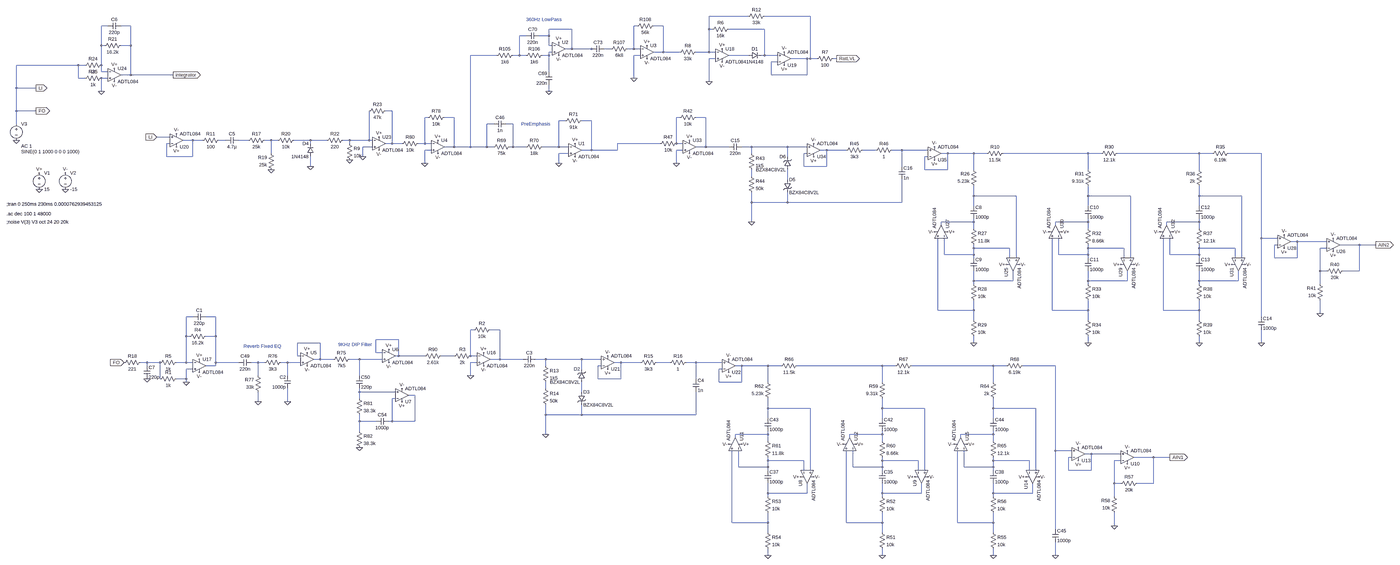
[diagram p0: schematic stargate_323_ltspice.asc, whole sheet]
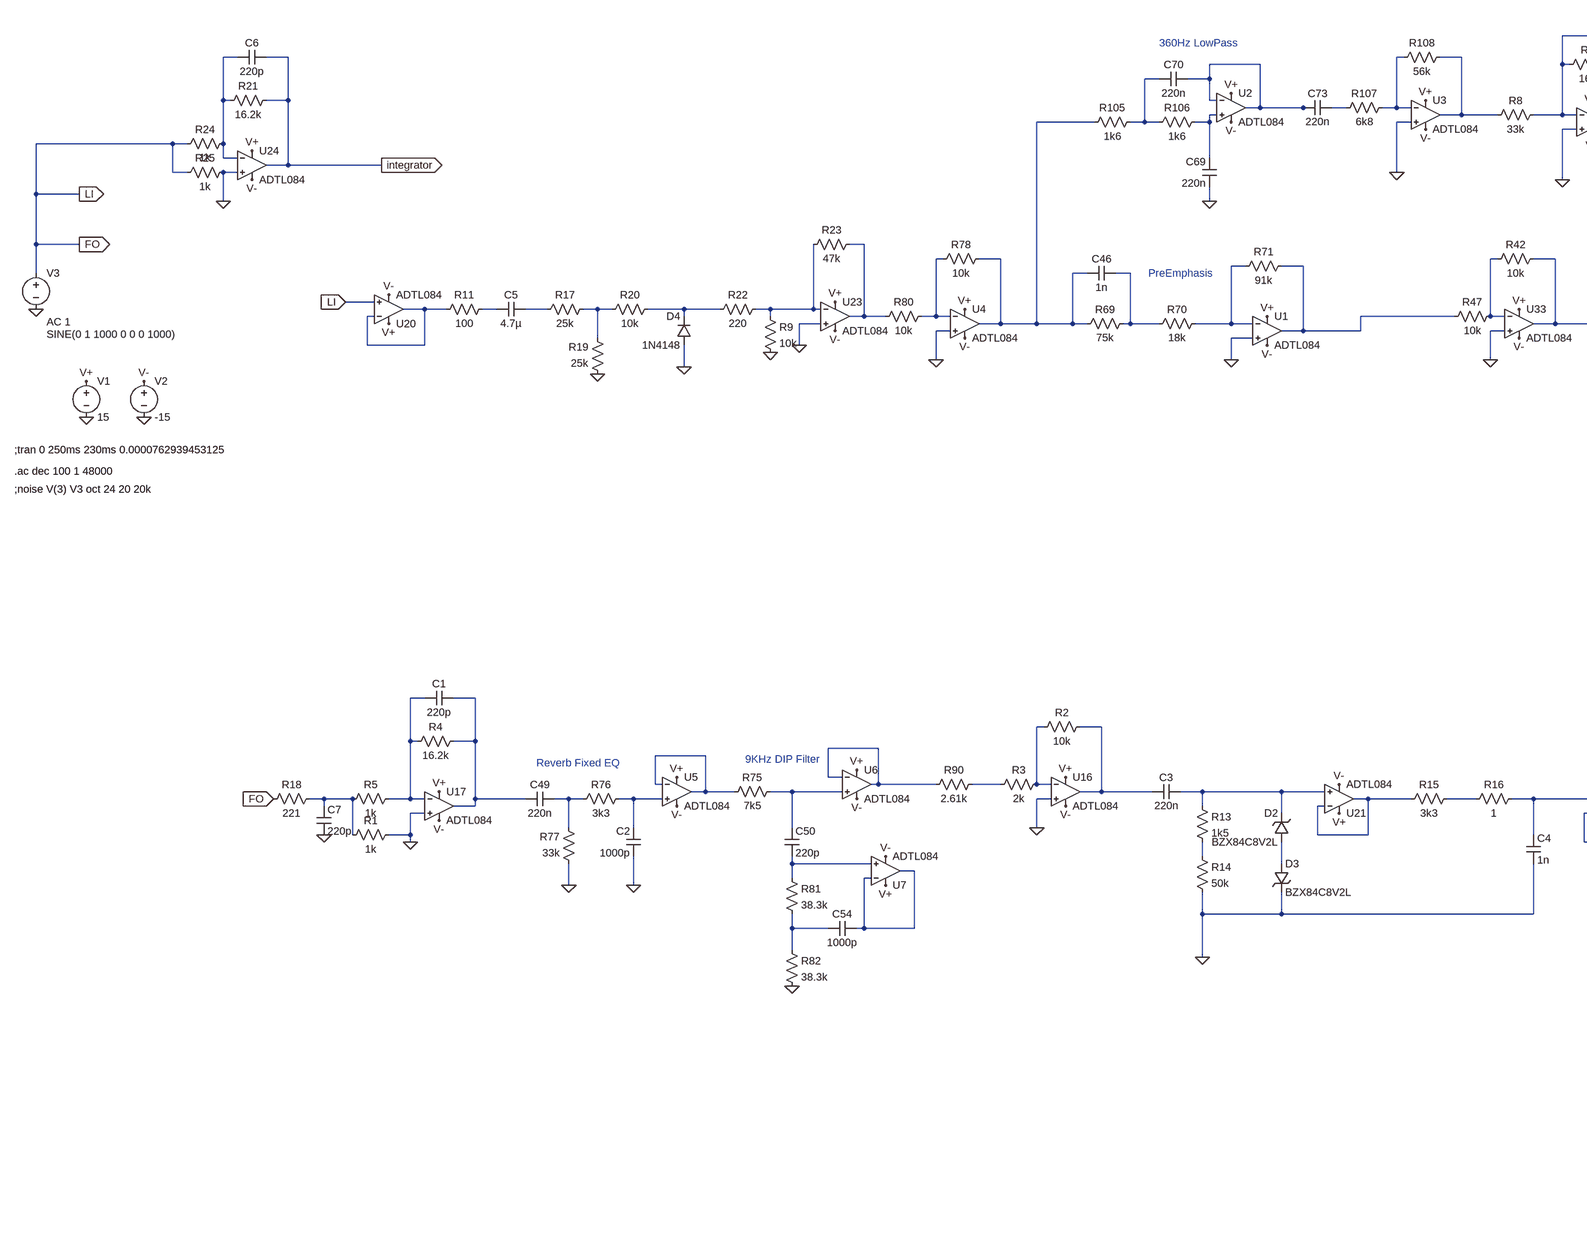
[diagram p1: schematic stargate_323_ltspice.asc, part, row 1 of 1, column 1 of 2]
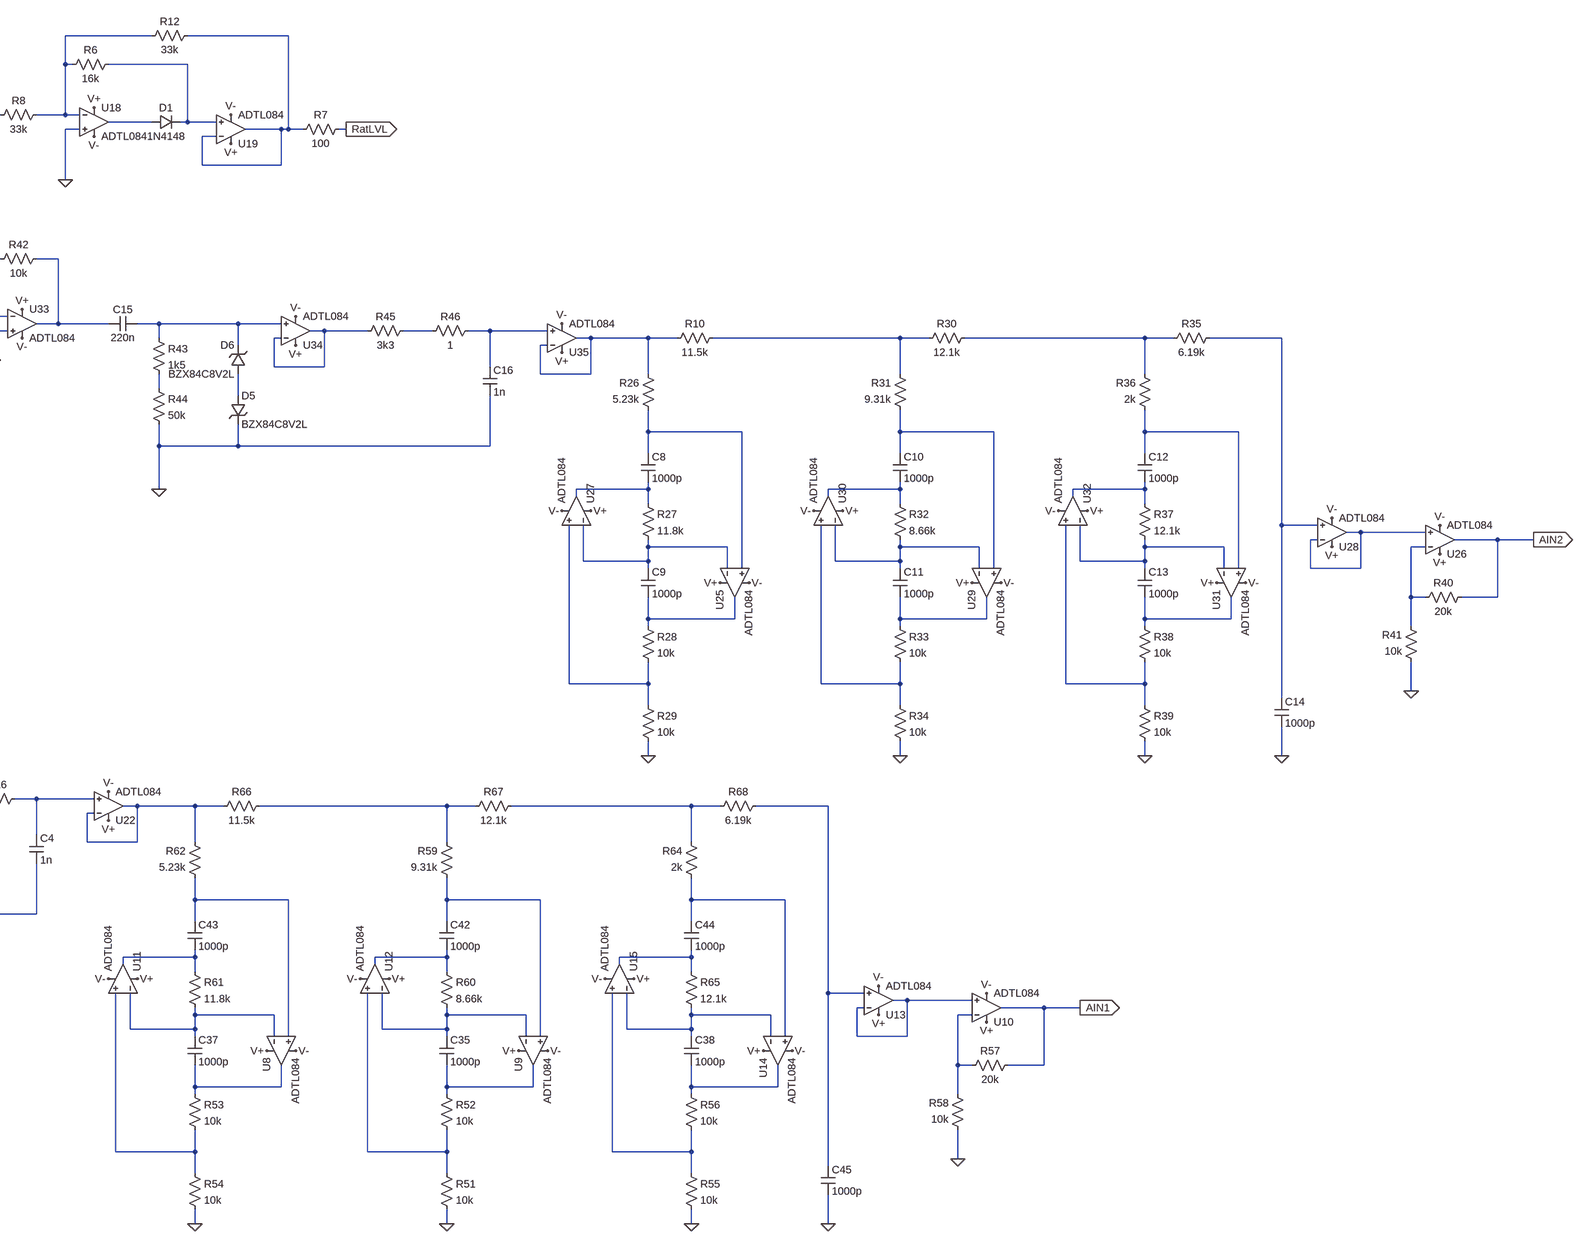
[diagram p2: schematic stargate_323_ltspice.asc, part, row 1 of 1, column 2 of 2]
stargate_323_ltspice.asc, the LTspice schematic file:
Version 4
SHEET 1 3908 2772
WIRE -416 112 -608 112
WIRE -112 112 -336 112
WIRE -3552 160 -3584 160
WIRE -3440 160 -3488 160
WIRE -960 160 -976 160
WIRE -832 160 -880 160
WIRE -1280 176 -1392 176
WIRE -608 176 -608 112
WIRE -592 176 -608 176
WIRE -336 176 -512 176
WIRE -1504 208 -1536 208
WIRE -1392 208 -1392 176
WIRE -1392 208 -1440 208
WIRE -3584 256 -3584 160
WIRE -3568 256 -3584 256
WIRE -3440 256 -3440 160
WIRE -3440 256 -3488 256
WIRE -1392 256 -1392 208
WIRE -1376 256 -1392 256
WIRE -1280 272 -1280 176
WIRE -1280 272 -1312 272
WIRE -1184 272 -1280 272
WIRE -1168 272 -1184 272
WIRE -1088 272 -1120 272
WIRE -976 272 -976 160
WIRE -976 272 -1008 272
WIRE -944 272 -976 272
WIRE -1376 288 -1392 288
WIRE -832 288 -832 160
WIRE -832 288 -880 288
WIRE -752 288 -832 288
WIRE -608 288 -608 176
WIRE -608 288 -672 288
WIRE -576 288 -608 288
WIRE -1648 304 -1776 304
WIRE -1536 304 -1536 208
WIRE -1536 304 -1568 304
WIRE -1504 304 -1536 304
WIRE -1392 304 -1392 288
WIRE -1392 304 -1424 304
WIRE -944 304 -976 304
WIRE -416 304 -512 304
WIRE -336 304 -336 176
WIRE -336 304 -352 304
WIRE -272 304 -336 304
WIRE -576 320 -608 320
WIRE -128 320 -208 320
WIRE -112 320 -112 112
WIRE -112 320 -128 320
WIRE -80 320 -112 320
WIRE 16 320 0 320
WIRE -272 336 -304 336
WIRE -3696 352 -4000 352
WIRE -3664 352 -3696 352
WIRE -3584 352 -3584 256
WIRE -3584 384 -3584 352
WIRE -3552 384 -3584 384
WIRE -1392 384 -1392 304
WIRE -3440 400 -3440 256
WIRE -3440 400 -3488 400
WIRE -3232 400 -3440 400
WIRE -304 400 -304 336
WIRE -128 400 -128 320
WIRE -128 400 -304 400
WIRE -3696 416 -3696 352
WIRE -3664 416 -3696 416
WIRE -3552 416 -3584 416
WIRE -976 416 -976 304
WIRE -608 432 -608 320
WIRE -4000 464 -4000 352
WIRE -3904 464 -4000 464
WIRE -3584 480 -3584 416
WIRE -1392 480 -1392 448
WIRE -4000 576 -4000 464
WIRE -3904 576 -4000 576
WIRE -2160 576 -2192 576
WIRE -1984 608 -2000 608
WIRE -1856 608 -1904 608
WIRE -752 608 -768 608
WIRE -624 608 -672 608
WIRE -1312 624 -1344 624
WIRE -1184 624 -1232 624
WIRE -4000 640 -4000 576
WIRE -1664 640 -1696 640
WIRE -1568 640 -1600 640
WIRE -3248 704 -3312 704
WIRE -3136 720 -3184 720
WIRE -3088 720 -3136 720
WIRE -2976 720 -3008 720
WIRE -2864 720 -2912 720
WIRE -2752 720 -2784 720
WIRE -2720 720 -2752 720
WIRE -2560 720 -2640 720
WIRE -2480 720 -2560 720
WIRE -2368 720 -2400 720
WIRE -2272 720 -2272 576
WIRE -2272 720 -2368 720
WIRE -2256 720 -2272 720
WIRE -3248 736 -3264 736
WIRE -2560 736 -2560 720
WIRE -2368 736 -2368 720
WIRE -2160 736 -2160 576
WIRE -2160 736 -2192 736
WIRE -2112 736 -2160 736
WIRE -2000 736 -2000 608
WIRE -2000 736 -2032 736
WIRE -1968 736 -2000 736
WIRE -848 736 -1056 736
WIRE -768 736 -768 608
WIRE -736 736 -768 736
WIRE -2256 752 -2304 752
WIRE -1856 752 -1856 608
WIRE -1856 752 -1904 752
WIRE -1776 752 -1776 304
WIRE -1776 752 -1856 752
WIRE -1696 752 -1696 640
WIRE -1696 752 -1776 752
WIRE -1664 752 -1696 752
WIRE -1568 752 -1568 640
WIRE -1568 752 -1584 752
WIRE -1504 752 -1568 752
WIRE -1344 752 -1344 624
WIRE -1344 752 -1424 752
WIRE -1296 752 -1344 752
WIRE -624 752 -624 608
WIRE -624 752 -672 752
WIRE -512 752 -624 752
WIRE -400 752 -448 752
WIRE -224 752 -400 752
WIRE -128 752 -224 752
WIRE -1968 768 -2000 768
WIRE -1184 768 -1184 624
WIRE -1184 768 -1232 768
WIRE -1056 768 -1056 736
WIRE -1056 768 -1184 768
WIRE -736 768 -768 768
WIRE -32 768 -64 768
WIRE 64 768 -32 768
WIRE 208 768 144 768
WIRE 336 768 288 768
WIRE 464 768 336 768
WIRE -2752 784 -2752 720
WIRE -1296 784 -1344 784
WIRE -400 784 -400 752
WIRE -128 784 -144 784
WIRE 560 784 528 784
WIRE 688 784 560 784
WIRE 752 784 688 784
WIRE 1248 784 832 784
WIRE 1312 784 1248 784
WIRE 1792 784 1392 784
WIRE 1856 784 1792 784
WIRE 2096 784 1936 784
WIRE -3264 800 -3264 736
WIRE -3136 800 -3136 720
WIRE -3136 800 -3264 800
WIRE -2304 800 -2304 752
WIRE -224 800 -224 752
WIRE 464 800 448 800
WIRE -2000 832 -2000 768
WIRE -1344 832 -1344 784
WIRE -768 832 -768 768
WIRE -2560 848 -2560 800
WIRE -144 848 -144 784
WIRE -32 848 -32 768
WIRE -32 848 -144 848
WIRE 336 848 336 768
WIRE 448 864 448 800
WIRE 560 864 560 784
WIRE 560 864 448 864
WIRE 688 864 688 784
WIRE 1248 864 1248 784
WIRE 1792 864 1792 784
WIRE -400 896 -400 864
WIRE -224 912 -224 864
WIRE 688 992 688 944
WIRE 896 992 688 992
WIRE 1248 992 1248 944
WIRE 1456 992 1248 992
WIRE 1792 992 1792 944
WIRE 2000 992 1792 992
WIRE -400 1024 -400 976
WIRE -224 1024 -224 976
WIRE -224 1024 -400 1024
WIRE 336 1024 336 912
WIRE 336 1024 -224 1024
WIRE 688 1040 688 992
WIRE 1248 1040 1248 992
WIRE 1792 1040 1792 992
WIRE -400 1120 -400 1024
WIRE 688 1120 688 1104
WIRE 688 1120 528 1120
WIRE 1248 1120 1248 1104
WIRE 1248 1120 1088 1120
WIRE 1792 1120 1792 1104
WIRE 1792 1120 1632 1120
WIRE 528 1136 528 1120
WIRE 1088 1136 1088 1120
WIRE 1632 1136 1632 1120
WIRE 688 1152 688 1120
WIRE 1248 1152 1248 1120
WIRE 1792 1152 1792 1120
WIRE 2096 1200 2096 784
WIRE 2176 1200 2096 1200
WIRE 2272 1216 2240 1216
WIRE 2416 1216 2272 1216
WIRE 2176 1232 2160 1232
WIRE 2576 1232 2480 1232
WIRE 2656 1232 2576 1232
WIRE 688 1248 688 1232
WIRE 864 1248 688 1248
WIRE 1248 1248 1248 1232
WIRE 1424 1248 1248 1248
WIRE 1792 1248 1792 1232
WIRE 1968 1248 1792 1248
WIRE 2416 1248 2384 1248
WIRE 544 1280 544 1200
WIRE 688 1280 688 1248
WIRE 688 1280 544 1280
WIRE 1104 1280 1104 1200
WIRE 1248 1280 1248 1248
WIRE 1248 1280 1104 1280
WIRE 1648 1280 1648 1200
WIRE 1792 1280 1792 1248
WIRE 1792 1280 1648 1280
WIRE 688 1296 688 1280
WIRE 864 1296 864 1248
WIRE 896 1296 896 992
WIRE 1248 1296 1248 1280
WIRE 1424 1296 1424 1248
WIRE 1456 1296 1456 992
WIRE 1792 1296 1792 1280
WIRE 1968 1296 1968 1248
WIRE 2000 1296 2000 992
WIRE 2160 1296 2160 1232
WIRE 2272 1296 2272 1216
WIRE 2272 1296 2160 1296
WIRE 2384 1360 2384 1248
WIRE 2416 1360 2384 1360
WIRE 2576 1360 2576 1232
WIRE 2576 1360 2496 1360
WIRE 688 1408 688 1360
WIRE 880 1408 880 1360
WIRE 880 1408 688 1408
WIRE 1248 1408 1248 1360
WIRE 1440 1408 1440 1360
WIRE 1440 1408 1248 1408
WIRE 1792 1408 1792 1360
WIRE 1984 1408 1984 1360
WIRE 1984 1408 1792 1408
WIRE 688 1424 688 1408
WIRE 1248 1424 1248 1408
WIRE 1792 1424 1792 1408
WIRE 2384 1424 2384 1360
WIRE 512 1552 512 1200
WIRE 688 1552 688 1504
WIRE 688 1552 512 1552
WIRE 1072 1552 1072 1200
WIRE 1248 1552 1248 1504
WIRE 1248 1552 1072 1552
WIRE 1616 1552 1616 1200
WIRE 1792 1552 1792 1504
WIRE 1792 1552 1616 1552
WIRE 2384 1568 2384 1504
WIRE -3136 1584 -3168 1584
WIRE -3024 1584 -3072 1584
WIRE 2096 1584 2096 1200
WIRE 688 1600 688 1552
WIRE 1248 1600 1248 1552
WIRE 1792 1600 1792 1552
WIRE -1760 1648 -1776 1648
WIRE -1632 1648 -1680 1648
WIRE -3168 1680 -3168 1584
WIRE -3152 1680 -3168 1680
WIRE -3024 1680 -3024 1584
WIRE -3024 1680 -3072 1680
WIRE -2128 1696 -2240 1696
WIRE -2512 1712 -2624 1712
WIRE 688 1712 688 1680
WIRE 1248 1712 1248 1680
WIRE 1792 1712 1792 1680
WIRE 2096 1712 2096 1648
WIRE -2240 1760 -2240 1696
WIRE -2208 1760 -2240 1760
WIRE -2624 1776 -2624 1712
WIRE -2608 1776 -2624 1776
WIRE -2128 1776 -2128 1696
WIRE -2128 1776 -2144 1776
WIRE -2000 1776 -2128 1776
WIRE -1856 1776 -1920 1776
WIRE -1776 1776 -1776 1648
WIRE -1744 1776 -1776 1776
WIRE -2512 1792 -2512 1712
WIRE -2512 1792 -2544 1792
WIRE -2448 1792 -2512 1792
WIRE -2320 1792 -2368 1792
WIRE -2208 1792 -2320 1792
WIRE -1632 1792 -1632 1648
WIRE -1632 1792 -1680 1792
WIRE -1520 1792 -1632 1792
WIRE -1408 1792 -1456 1792
WIRE -1232 1792 -1408 1792
WIRE -1136 1792 -1232 1792
WIRE -3360 1808 -3392 1808
WIRE -3296 1808 -3360 1808
WIRE -3168 1808 -3168 1680
WIRE -3168 1808 -3216 1808
WIRE -3136 1808 -3168 1808
WIRE -3024 1808 -3024 1680
WIRE -2912 1808 -3024 1808
WIRE -2816 1808 -2848 1808
WIRE -2784 1808 -2816 1808
WIRE -2672 1808 -2704 1808
WIRE -2608 1808 -2672 1808
WIRE -1744 1808 -1776 1808
WIRE -1040 1808 -1072 1808
WIRE -944 1808 -1040 1808
WIRE -800 1808 -864 1808
WIRE -672 1808 -720 1808
WIRE -544 1808 -672 1808
WIRE -3360 1824 -3360 1808
WIRE -3024 1824 -3024 1808
WIRE -3024 1824 -3072 1824
WIRE -1408 1824 -1408 1792
WIRE -1136 1824 -1152 1824
WIRE -448 1824 -480 1824
WIRE -320 1824 -448 1824
WIRE -256 1824 -320 1824
WIRE 240 1824 -176 1824
WIRE 304 1824 240 1824
WIRE 784 1824 384 1824
WIRE 848 1824 784 1824
WIRE 1088 1824 928 1824
WIRE -3136 1840 -3168 1840
WIRE -1232 1840 -1232 1792
WIRE -544 1840 -560 1840
WIRE -2816 1872 -2816 1808
WIRE -2672 1872 -2672 1808
WIRE -2320 1872 -2320 1792
WIRE -1776 1872 -1776 1808
WIRE -3296 1888 -3296 1808
WIRE -3168 1888 -3168 1840
WIRE -3168 1888 -3216 1888
WIRE -1152 1888 -1152 1824
WIRE -1040 1888 -1040 1808
WIRE -1040 1888 -1152 1888
WIRE -672 1888 -672 1808
WIRE -3168 1904 -3168 1888
WIRE -560 1904 -560 1840
WIRE -448 1904 -448 1824
WIRE -448 1904 -560 1904
WIRE -320 1904 -320 1824
WIRE 240 1904 240 1824
WIRE 784 1904 784 1824
WIRE -1408 1936 -1408 1904
WIRE -2320 1952 -2320 1936
WIRE -2144 1952 -2320 1952
WIRE -1232 1952 -1232 1904
WIRE -2048 1968 -2080 1968
WIRE -2320 1984 -2320 1952
WIRE -2144 1984 -2160 1984
WIRE -2816 2000 -2816 1952
WIRE -2672 2000 -2672 1936
WIRE -320 2032 -320 1984
WIRE -112 2032 -320 2032
WIRE 240 2032 240 1984
WIRE 448 2032 240 2032
WIRE 784 2032 784 1984
WIRE 992 2032 784 2032
WIRE -1408 2064 -1408 2016
WIRE -1232 2064 -1232 2016
WIRE -1232 2064 -1408 2064
WIRE -672 2064 -672 1952
WIRE -672 2064 -1232 2064
WIRE -320 2080 -320 2032
WIRE 240 2080 240 2032
WIRE 784 2080 784 2032
WIRE -2320 2096 -2320 2064
WIRE -2240 2096 -2320 2096
WIRE -2160 2096 -2160 1984
WIRE -2160 2096 -2176 2096
WIRE -2048 2096 -2048 1968
WIRE -2048 2096 -2160 2096
WIRE -2320 2144 -2320 2096
WIRE -1408 2160 -1408 2064
WIRE -320 2160 -320 2144
WIRE -320 2160 -480 2160
WIRE 240 2160 240 2144
WIRE 240 2160 80 2160
WIRE 784 2160 784 2144
WIRE 784 2160 624 2160
WIRE -480 2176 -480 2160
WIRE 80 2176 80 2160
WIRE 624 2176 624 2160
WIRE -320 2192 -320 2160
WIRE 240 2192 240 2160
WIRE 784 2192 784 2160
WIRE 1088 2240 1088 1824
WIRE 1168 2240 1088 2240
WIRE 1264 2256 1232 2256
WIRE 1408 2256 1264 2256
WIRE 1168 2272 1152 2272
WIRE 1568 2272 1472 2272
WIRE 1648 2272 1568 2272
WIRE -320 2288 -320 2272
WIRE -144 2288 -320 2288
WIRE 240 2288 240 2272
WIRE 416 2288 240 2288
WIRE 784 2288 784 2272
WIRE 960 2288 784 2288
WIRE 1408 2288 1376 2288
WIRE -464 2320 -464 2240
WIRE -320 2320 -320 2288
WIRE -320 2320 -464 2320
WIRE 96 2320 96 2240
WIRE 240 2320 240 2288
WIRE 240 2320 96 2320
WIRE 640 2320 640 2240
WIRE 784 2320 784 2288
WIRE 784 2320 640 2320
WIRE -320 2336 -320 2320
WIRE -144 2336 -144 2288
WIRE -112 2336 -112 2032
WIRE 240 2336 240 2320
WIRE 416 2336 416 2288
WIRE 448 2336 448 2032
WIRE 784 2336 784 2320
WIRE 960 2336 960 2288
WIRE 992 2336 992 2032
WIRE 1152 2336 1152 2272
WIRE 1264 2336 1264 2256
WIRE 1264 2336 1152 2336
WIRE 1376 2400 1376 2288
WIRE 1408 2400 1376 2400
WIRE 1568 2400 1568 2272
WIRE 1568 2400 1488 2400
WIRE -320 2448 -320 2400
WIRE -128 2448 -128 2400
WIRE -128 2448 -320 2448
WIRE 240 2448 240 2400
WIRE 432 2448 432 2400
WIRE 432 2448 240 2448
WIRE 784 2448 784 2400
WIRE 976 2448 976 2400
WIRE 976 2448 784 2448
WIRE -320 2464 -320 2448
WIRE 240 2464 240 2448
WIRE 784 2464 784 2448
WIRE 1376 2464 1376 2400
WIRE -496 2592 -496 2240
WIRE -320 2592 -320 2544
WIRE -320 2592 -496 2592
WIRE 64 2592 64 2240
WIRE 240 2592 240 2544
WIRE 240 2592 64 2592
WIRE 608 2592 608 2240
WIRE 784 2592 784 2544
WIRE 784 2592 608 2592
WIRE 1376 2608 1376 2544
WIRE 1088 2624 1088 2240
WIRE -320 2640 -320 2592
WIRE 240 2640 240 2592
WIRE 784 2640 784 2592
WIRE -320 2752 -320 2720
WIRE 240 2752 240 2720
WIRE 784 2752 784 2720
WIRE 1088 2752 1088 2688
FLAG -3888 960 0
FLAG -3888 880 V+
FLAG -3760 960 0
FLAG -3760 880 V-
FLAG -4000 720 0
FLAG -1264 736 V+
FLAG -1264 800 V-
FLAG -1344 832 0
FLAG -1344 240 V+
FLAG -1344 304 V-
FLAG -1392 480 0
FLAG 16 320 RatLVL
IOPIN 16 320 Out
FLAG -912 256 V+
FLAG -912 320 V-
FLAG -976 416 0
FLAG -1936 720 V+
FLAG -1936 784 V-
FLAG -2000 832 0
FLAG -2576 1760 V+
FLAG -2576 1824 V-
FLAG -2176 1744 V+
FLAG -2176 1808 V-
FLAG -2112 2000 V+
FLAG -2112 1936 V-
FLAG -2816 2000 0
FLAG -2672 2000 0
FLAG -2320 2224 0
FLAG -160 2368 V+
FLAG -96 2368 V-
FLAG 1440 2304 V+
FLAG 1440 2240 V-
FLAG -448 2208 V+
FLAG -512 2208 V-
FLAG 1200 2288 V+
FLAG 1200 2224 V-
FLAG -320 2752 0
FLAG 400 2368 V+
FLAG 464 2368 V-
FLAG 112 2208 V+
FLAG 48 2208 V-
FLAG 240 2752 0
FLAG 944 2368 V+
FLAG 1008 2368 V-
FLAG 656 2208 V+
FLAG 592 2208 V-
FLAG 784 2752 0
FLAG 1088 2752 0
FLAG 1376 2608 0
FLAG 1648 2272 AIN1
IOPIN 1648 2272 Out
FLAG -1712 1760 V+
FLAG -1712 1824 V-
FLAG -1776 1872 0
FLAG -3104 1792 V+
FLAG -3104 1856 V-
FLAG -3168 1904 0
FLAG -544 272 V+
FLAG -544 336 V-
FLAG -608 432 0
FLAG -240 352 V+
FLAG -240 288 V-
FLAG -1408 2160 0
FLAG -1104 1840 V+
FLAG -1104 1776 V-
FLAG -512 1856 V+
FLAG -512 1792 V-
FLAG -3312 704 LI
IOPIN -3312 704 In
FLAG -3904 464 LI
IOPIN -3904 464 Out
FLAG -3904 576 FO
IOPIN -3904 576 Out
FLAG -3360 1888 0
FLAG -2224 704 V+
FLAG -2224 768 V-
FLAG -2304 800 0
FLAG -2368 816 0
FLAG -3216 752 V+
FLAG -3216 688 V-
FLAG -2752 864 0
FLAG -2560 848 0
FLAG -3520 368 V+
FLAG -3520 432 V-
FLAG -3584 480 0
FLAG -3232 400 integrator
IOPIN -3232 400 Out
FLAG -3472 1808 FO
IOPIN -3472 1808 In
FLAG 848 1328 V+
FLAG 912 1328 V-
FLAG 2448 1264 V+
FLAG 2448 1200 V-
FLAG 560 1168 V+
FLAG 496 1168 V-
FLAG 2208 1248 V+
FLAG 2208 1184 V-
FLAG 688 1712 0
FLAG 1408 1328 V+
FLAG 1472 1328 V-
FLAG 1120 1168 V+
FLAG 1056 1168 V-
FLAG 1248 1712 0
FLAG 1952 1328 V+
FLAG 2016 1328 V-
FLAG 1664 1168 V+
FLAG 1600 1168 V-
FLAG 1792 1712 0
FLAG 2096 1712 0
FLAG 2384 1568 0
FLAG 2656 1232 AIN2
IOPIN 2656 1232 Out
FLAG -704 720 V+
FLAG -704 784 V-
FLAG -768 832 0
FLAG -400 1120 0
FLAG -96 800 V+
FLAG -96 736 V-
FLAG 496 816 V+
FLAG 496 752 V-
SYMBOL voltage -3888 864 R0
WINDOW 123 0 0 Left 0
WINDOW 39 0 0 Left 0
SYMATTR InstName V1
SYMATTR Value 15
SYMBOL voltage -3760 864 R0
WINDOW 123 0 0 Left 0
WINDOW 39 0 0 Left 0
SYMATTR InstName V2
SYMATTR Value -15
SYMBOL voltage -4000 624 R0
WINDOW 3 24 152 Left 2
WINDOW 123 24 124 Left 2
WINDOW 39 0 0 Left 0
SYMATTR Value SINE(0 1 1000 0 0 0 1000)
SYMATTR Value2 AC 1
SYMATTR InstName V3
SYMBOL OpAmps\\ADTL084 -1264 704 R0
SYMATTR InstName U1
SYMBOL res -1568 736 R90
WINDOW 0 0 56 VBottom 2
WINDOW 3 32 56 VTop 2
SYMATTR InstName R69
SYMATTR Value 75k
SYMBOL res -1408 736 R90
WINDOW 0 0 56 VBottom 2
WINDOW 3 32 56 VTop 2
SYMATTR InstName R70
SYMATTR Value 18k
SYMBOL res -1216 608 R90
WINDOW 0 0 56 VBottom 2
WINDOW 3 32 56 VTop 2
SYMATTR InstName R71
SYMATTR Value 91k
SYMBOL cap -1600 624 R90
WINDOW 0 0 32 VBottom 2
WINDOW 3 32 32 VTop 2
SYMATTR InstName C46
SYMATTR Value 1n
SYMBOL res -1552 288 R90
WINDOW 0 0 56 VBottom 2
WINDOW 3 32 56 VTop 2
SYMATTR InstName R105
SYMATTR Value 1k6
SYMBOL res -1408 288 R90
WINDOW 0 0 56 VBottom 2
WINDOW 3 32 56 VTop 2
SYMATTR InstName R106
SYMATTR Value 1k6
SYMBOL cap -1440 192 R90
WINDOW 0 0 32 VBottom 2
WINDOW 3 32 32 VTop 2
SYMATTR InstName C70
SYMATTR Value 220n
SYMBOL cap -1376 448 R180
WINDOW 0 24 56 Left 2
WINDOW 3 24 8 Left 2
SYMATTR InstName C69
SYMATTR Value 220n
SYMBOL OpAmps\\ADTL084 -1344 208 R0
SYMATTR InstName U2
SYMBOL cap -1120 256 R90
WINDOW 0 0 32 VBottom 2
WINDOW 3 32 32 VTop 2
SYMATTR InstName C73
SYMATTR Value 220n
SYMBOL res -992 256 R90
WINDOW 0 0 56 VBottom 2
WINDOW 3 32 56 VTop 2
SYMATTR InstName R107
SYMATTR Value 6k8
SYMBOL res -864 144 R90
WINDOW 0 0 56 VBottom 2
WINDOW 3 32 56 VTop 2
SYMATTR InstName R108
SYMATTR Value 56k
SYMBOL OpAmps\\ADTL084 -912 224 R0
SYMATTR InstName U3
SYMBOL OpAmps\\ADTL084 -1936 688 R0
SYMATTR InstName U4
SYMBOL res -1888 592 R90
WINDOW 0 0 56 VBottom 2
WINDOW 3 32 56 VTop 2
SYMATTR InstName R78
SYMATTR Value 10k
SYMBOL res -2016 720 R90
WINDOW 0 0 56 VBottom 2
WINDOW 3 32 56 VTop 2
SYMATTR InstName R80
SYMATTR Value 10k
SYMBOL cap -2848 1792 R90
WINDOW 0 0 32 VBottom 2
WINDOW 3 32 32 VTop 2
SYMATTR InstName C49
SYMATTR Value 220n
SYMBOL cap -2656 1936 R180
WINDOW 0 24 56 Left 2
WINDOW 3 24 8 Left 2
SYMATTR InstName C2
SYMATTR Value 1000p
SYMBOL res -2688 1792 R90
WINDOW 0 0 56 VBottom 2
WINDOW 3 32 56 VTop 2
SYMATTR InstName R76
SYMATTR Value 3k3
SYMBOL res -2800 1968 R180
WINDOW 0 36 76 Left 2
WINDOW 3 36 40 Left 2
SYMATTR InstName R77
SYMATTR Value 33k
SYMBOL OpAmps\\ADTL084 -2576 1728 R0
SYMATTR InstName U5
SYMBOL res -2352 1776 R90
WINDOW 0 0 56 VBottom 2
WINDOW 3 32 56 VTop 2
SYMATTR InstName R75
SYMATTR Value 7k5
SYMBOL cap -2336 1872 R0
SYMATTR InstName C50
SYMATTR Value 220p
SYMBOL res -2336 1968 R0
SYMATTR InstName R81
SYMATTR Value 38.3k
SYMBOL res -2336 2128 R0
SYMATTR InstName R82
SYMATTR Value 38.3k
SYMBOL cap -2176 2080 R90
WINDOW 0 0 32 VBottom 2
WINDOW 3 32 32 VTop 2
SYMATTR InstName C54
SYMATTR Value 1000p
SYMBOL OpAmps\\ADTL084 -2176 1712 R0
SYMATTR InstName U6
SYMBOL OpAmps\\ADTL084 -2112 2032 M180
SYMATTR InstName U7
SYMBOL res -1904 1760 R90
WINDOW 0 0 56 VBottom 2
WINDOW 3 32 56 VTop 2
SYMATTR InstName R90
SYMATTR Value 2.61k
SYMBOL OpAmps\\ADTL084 -192 2368 M90
SYMATTR InstName U8
SYMBOL OpAmps\\ADTL084 1440 2336 M180
SYMATTR InstName U10
SYMBOL OpAmps\\ADTL084 -416 2208 M270
SYMATTR InstName U11
SYMBOL OpAmps\\ADTL084 1200 2320 M180
SYMATTR InstName U13
SYMBOL res -160 1808 R90
WINDOW 0 0 56 VBottom 2
WINDOW 3 32 56 VTop 2
SYMATTR InstName R66
SYMATTR Value 11.5k
SYMBOL res -304 2000 R180
WINDOW 0 36 76 Left 2
WINDOW 3 36 40 Left 2
SYMATTR InstName R62
SYMATTR Value 5.23k
SYMBOL cap -336 2080 R0
SYMATTR InstName C43
SYMATTR Value 1000p
SYMBOL res -336 2176 R0
SYMATTR InstName R61
SYMATTR Value 11.8k
SYMBOL cap -336 2336 R0
SYMATTR InstName C37
SYMATTR Value 1000p
SYMBOL res -336 2448 R0
SYMATTR InstName R53
SYMATTR Value 10k
SYMBOL res -336 2624 R0
SYMATTR InstName R54
SYMATTR Value 10k
SYMBOL OpAmps\\ADTL084 368 2368 M90
SYMATTR InstName U9
SYMBOL OpAmps\\ADTL084 144 2208 M270
SYMATTR InstName U12
SYMBOL res 400 1808 R90
WINDOW 0 0 56 VBottom 2
WINDOW 3 32 56 VTop 2
SYMATTR InstName R67
SYMATTR Value 12.1k
SYMBOL res 256 2000 R180
WINDOW 0 36 76 Left 2
WINDOW 3 36 40 Left 2
SYMATTR InstName R59
SYMATTR Value 9.31k
SYMBOL cap 224 2080 R0
SYMATTR InstName C42
SYMATTR Value 1000p
SYMBOL res 224 2176 R0
SYMATTR InstName R60
SYMATTR Value 8.66k
SYMBOL cap 224 2336 R0
SYMATTR InstName C35
SYMATTR Value 1000p
SYMBOL res 224 2448 R0
SYMATTR InstName R52
SYMATTR Value 10k
SYMBOL res 224 2624 R0
SYMATTR InstName R51
SYMATTR Value 10k
SYMBOL OpAmps\\ADTL084 912 2368 M90
SYMATTR InstName U14
SYMBOL OpAmps\\ADTL084 688 2208 M270
SYMATTR InstName U15
SYMBOL res 944 1808 R90
WINDOW 0 0 56 VBottom 2
WINDOW 3 32 56 VTop 2
SYMATTR InstName R68
SYMATTR Value 6.19k
SYMBOL res 800 2000 R180
WINDOW 0 36 76 Left 2
WINDOW 3 36 40 Left 2
SYMATTR InstName R64
SYMATTR Value 2k
SYMBOL cap 768 2080 R0
SYMATTR InstName C44
SYMATTR Value 1000p
SYMBOL res 768 2176 R0
SYMATTR InstName R65
SYMATTR Value 12.1k
SYMBOL cap 768 2336 R0
SYMATTR InstName C38
SYMATTR Value 1000p
SYMBOL res 768 2448 R0
SYMATTR InstName R56
SYMATTR Value 10k
SYMBOL res 768 2624 R0
SYMATTR InstName R55
SYMATTR Value 10k
SYMBOL cap 1072 2624 R0
SYMATTR InstName C45
SYMATTR Value 1000p
SYMBOL res 1504 2384 R90
WINDOW 0 0 56 VBottom 2
WINDOW 3 32 56 VTop 2
SYMATTR InstName R57
SYMATTR Value 20k
SYMBOL res 1392 2560 R180
WINDOW 0 36 76 Left 2
WINDOW 3 36 40 Left 2
SYMATTR InstName R58
SYMATTR Value 10k
SYMBOL OpAmps\\ADTL084 -1712 1728 R0
SYMATTR InstName U16
SYMBOL res -1664 1632 R90
WINDOW 0 0 56 VBottom 2
WINDOW 3 32 56 VTop 2
SYMATTR InstName R2
SYMATTR Value 10k
SYMBOL res -1760 1760 R90
WINDOW 0 0 56 VBottom 2
WINDOW 3 32 56 VTop 2
SYMATTR InstName R3
SYMATTR Value 2k
SYMBOL OpAmps\\ADTL084 -3104 1760 R0
SYMATTR InstName U17
SYMBOL res -3056 1664 R90
WINDOW 0 0 56 VBottom 2
WINDOW 3 32 56 VTop 2
SYMATTR InstName R4
SYMATTR Value 16.2k
SYMBOL cap -3072 1568 R90
WINDOW 0 0 32 VBottom 2
WINDOW 3 32 32 VTop 2
SYMATTR InstName C1
SYMATTR Value 220p
SYMBOL res -3200 1792 R90
WINDOW 0 0 56 VBottom 2
WINDOW 3 32 56 VTop 2
SYMATTR InstName R5
SYMATTR Value 1k
SYMBOL res -496 160 R90
WINDOW 0 0 56 VBottom 2
WINDOW 3 32 56 VTop 2
SYMATTR InstName R6
SYMATTR Value 16k
SYMBOL OpAmps\\ADTL084 -544 240 R0
SYMATTR InstName U18
SYMBOL OpAmps\\ADTL084 -240 384 M180
SYMATTR InstName U19
SYMBOL res -656 272 R90
WINDOW 0 0 56 VBottom 2
WINDOW 3 32 56 VTop 2
SYMATTR InstName R8
SYMATTR Value 33k
SYMBOL res 16 304 R90
WINDOW 0 0 56 VBottom 2
WINDOW 3 32 56 VTop 2
SYMATTR InstName R7
SYMATTR Value 100
SYMBOL res -320 96 R90
WINDOW 0 0 56 VBottom 2
WINDOW 3 32 56 VTop 2
SYMATTR InstName R12
SYMATTR Value 33k
SYMBOL diode -416 320 R270
WINDOW 0 32 32 VTop 2
WINDOW 3 0 32 VBottom 2
SYMATTR InstName D1
SYMATTR Value 1N4148
SYMBOL cap -1456 1776 R90
WINDOW 0 0 32 VBottom 2
WINDOW 3 32 32 VTop 2
SYMATTR InstName C3
SYMATTR Value 220n
SYMBOL res -1424 1808 R0
SYMATTR InstName R13
SYMATTR Value 1k5
SYMBOL res -1424 1920 R0
SYMATTR InstName R14
SYMATTR Value 50k
SYMBOL zener -1248 1952 R0
SYMATTR InstName D3
SYMATTR Value BZX84C8V2L
SYMBOL zener -1216 1904 R180
WINDOW 0 24 64 Left 2
WINDOW 3 24 0 Left 2
SYMATTR InstName D2
SYMATTR Value BZX84C8V2L
SYMBOL OpAmps\\ADTL084 -1104 1872 M180
SYMATTR InstName U21
SYMBOL res -848 1792 R90
WINDOW 0 0 56 VBottom 2
WINDOW 3 32 56 VTop 2
SYMATTR InstName R15
SYMATTR Value 3k3
SYMBOL res -704 1792 R90
WINDOW 0 0 56 VBottom 2
WINDOW 3 32 56 VTop 2
SYMATTR InstName R16
SYMATTR Value 1
SYMBOL cap -688 1888 R0
SYMATTR InstName C4
SYMATTR Value 1n
SYMBOL OpAmps\\ADTL084 -512 1888 M180
SYMATTR InstName U22
SYMBOL res -3200 1872 R90
WINDOW 0 0 56 VBottom 2
WINDOW 3 32 56 VTop 2
SYMATTR InstName R1
SYMATTR Value 1k
SYMBOL res -3376 1792 R90
WINDOW 0 0 56 VBottom 2
WINDOW 3 32 56 VTop 2
SYMATTR InstName R18
SYMATTR Value 221
SYMBOL cap -3376 1824 R0
SYMATTR InstName C7
SYMATTR Value 220p
SYMBOL OpAmps\\ADTL084 -2224 672 R0
SYMATTR InstName U23
SYMBOL res -2384 704 R90
WINDOW 0 0 56 VBottom 2
WINDOW 3 32 56 VTop 2
SYMATTR InstName R22
SYMATTR Value 220
SYMBOL res -2176 560 R90
WINDOW 0 0 56 VBottom 2
WINDOW 3 32 56 VTop 2
SYMATTR InstName R23
SYMATTR Value 47k
SYMBOL res -2384 720 R0
SYMATTR InstName R9
SYMATTR Value 10k
SYMBOL OpAmps\\ADTL084 -3216 784 M180
SYMATTR InstName U20
SYMBOL res -2992 704 R90
WINDOW 0 0 56 VBottom 2
WINDOW 3 32 56 VTop 2
SYMATTR InstName R11
SYMATTR Value 100
SYMBOL cap -2912 704 R90
WINDOW 0 0 32 VBottom 2
WINDOW 3 32 32 VTop 2
SYMATTR InstName C5
SYMATTR Value 4.7µ
SYMBOL res -2768 704 R90
WINDOW 0 0 56 VBottom 2
WINDOW 3 32 56 VTop 2
SYMATTR InstName R17
SYMATTR Value 25k
SYMBOL res -2736 880 R180
WINDOW 0 36 76 Left 2
WINDOW 3 36 40 Left 2
SYMATTR InstName R19
SYMATTR Value 25k
SYMBOL res -2624 704 R90
WINDOW 0 0 56 VBottom 2
WINDOW 3 32 56 VTop 2
SYMATTR InstName R20
SYMATTR Value 10k
SYMBOL diode -2544 800 R180
WINDOW 0 24 64 Left 2
WINDOW 3 24 0 Left 2
SYMATTR InstName D4
SYMATTR Value 1N4148
SYMBOL OpAmps\\ADTL084 -3520 336 R0
SYMATTR InstName U24
SYMBOL res -3472 240 R90
WINDOW 0 0 56 VBottom 2
WINDOW 3 32 56 VTop 2
SYMATTR InstName R21
SYMATTR Value 16.2k
SYMBOL cap -3488 144 R90
WINDOW 0 0 32 VBottom 2
WINDOW 3 32 32 VTop 2
SYMATTR InstName C6
SYMATTR Value 220p
SYMBOL res -3568 336 R90
WINDOW 0 0 56 VBottom 2
WINDOW 3 32 56 VTop 2
SYMATTR InstName R24
SYMATTR Value 1k
SYMBOL res -3568 400 R90
WINDOW 0 0 56 VBottom 2
WINDOW 3 32 56 VTop 2
SYMATTR InstName R25
SYMATTR Value 1k
SYMBOL OpAmps\\ADTL084 816 1328 M90
SYMATTR InstName U25
SYMBOL OpAmps\\ADTL084 2448 1296 M180
SYMATTR InstName U26
SYMBOL OpAmps\\ADTL084 592 1168 M270
SYMATTR InstName U27
SYMBOL OpAmps\\ADTL084 2208 1280 M180
SYMATTR InstName U28
SYMBOL res 848 768 R90
WINDOW 0 0 56 VBottom 2
WINDOW 3 32 56 VTop 2
SYMATTR InstName R10
SYMATTR Value 11.5k
SYMBOL res 704 960 R180
WINDOW 0 36 76 Left 2
WINDOW 3 36 40 Left 2
SYMATTR InstName R26
SYMATTR Value 5.23k
SYMBOL cap 672 1040 R0
SYMATTR InstName C8
SYMATTR Value 1000p
SYMBOL res 672 1136 R0
SYMATTR InstName R27
SYMATTR Value 11.8k
SYMBOL cap 672 1296 R0
SYMATTR InstName C9
SYMATTR Value 1000p
SYMBOL res 672 1408 R0
SYMATTR InstName R28
SYMATTR Value 10k
SYMBOL res 672 1584 R0
SYMATTR InstName R29
SYMATTR Value 10k
SYMBOL OpAmps\\ADTL084 1376 1328 M90
SYMATTR InstName U29
SYMBOL OpAmps\\ADTL084 1152 1168 M270
SYMATTR InstName U30
SYMBOL res 1408 768 R90
WINDOW 0 0 56 VBottom 2
WINDOW 3 32 56 VTop 2
SYMATTR InstName R30
SYMATTR Value 12.1k
SYMBOL res 1264 960 R180
WINDOW 0 36 76 Left 2
WINDOW 3 36 40 Left 2
SYMATTR InstName R31
SYMATTR Value 9.31k
SYMBOL cap 1232 1040 R0
SYMATTR InstName C10
SYMATTR Value 1000p
SYMBOL res 1232 1136 R0
SYMATTR InstName R32
SYMATTR Value 8.66k
SYMBOL cap 1232 1296 R0
SYMATTR InstName C11
SYMATTR Value 1000p
SYMBOL res 1232 1408 R0
SYMATTR InstName R33
SYMATTR Value 10k
SYMBOL res 1232 1584 R0
SYMATTR InstName R34
SYMATTR Value 10k
SYMBOL OpAmps\\ADTL084 1920 1328 M90
SYMATTR InstName U31
SYMBOL OpAmps\\ADTL084 1696 1168 M270
SYMATTR InstName U32
SYMBOL res 1952 768 R90
WINDOW 0 0 56 VBottom 2
WINDOW 3 32 56 VTop 2
SYMATTR InstName R35
SYMATTR Value 6.19k
SYMBOL res 1808 960 R180
WINDOW 0 36 76 Left 2
WINDOW 3 36 40 Left 2
SYMATTR InstName R36
SYMATTR Value 2k
SYMBOL cap 1776 1040 R0
SYMATTR InstName C12
SYMATTR Value 1000p
SYMBOL res 1776 1136 R0
SYMATTR InstName R37
SYMATTR Value 12.1k
SYMBOL cap 1776 1296 R0
SYMATTR InstName C13
SYMATTR Value 1000p
SYMBOL res 1776 1408 R0
SYMATTR InstName R38
SYMATTR Value 10k
SYMBOL res 1776 1584 R0
SYMATTR InstName R39
SYMATTR Value 10k
SYMBOL cap 2080 1584 R0
SYMATTR InstName C14
SYMATTR Value 1000p
SYMBOL res 2512 1344 R90
WINDOW 0 0 56 VBottom 2
WINDOW 3 32 56 VTop 2
SYMATTR InstName R40
SYMATTR Value 20k
SYMBOL res 2400 1520 R180
WINDOW 0 36 76 Left 2
WINDOW 3 36 40 Left 2
SYMATTR InstName R41
SYMATTR Value 10k
SYMBOL OpAmps\\ADTL084 -704 688 R0
SYMATTR InstName U33
SYMBOL res -656 592 R90
WINDOW 0 0 56 VBottom 2
WINDOW 3 32 56 VTop 2
SYMATTR InstName R42
SYMATTR Value 10k
SYMBOL cap -448 736 R90
WINDOW 0 0 32 VBottom 2
WINDOW 3 32 32 VTop 2
SYMATTR InstName C15
SYMATTR Value 220n
SYMBOL res -416 768 R0
SYMATTR InstName R43
SYMATTR Value 1k5
SYMBOL res -416 880 R0
SYMATTR InstName R44
SYMATTR Value 50k
SYMBOL zener -240 912 R0
SYMATTR InstName D5
SYMATTR Value BZX84C8V2L
SYMBOL zener -208 864 R180
WINDOW 0 24 64 Left 2
WINDOW 3 24 0 Left 2
SYMATTR InstName D6
SYMATTR Value BZX84C8V2L
SYMBOL OpAmps\\ADTL084 -96 832 M180
SYMATTR InstName U34
SYMBOL res 160 752 R90
WINDOW 0 0 56 VBottom 2
WINDOW 3 32 56 VTop 2
SYMATTR InstName R45
SYMATTR Value 3k3
SYMBOL res 304 752 R90
WINDOW 0 0 56 VBottom 2
WINDOW 3 32 56 VTop 2
SYMATTR InstName R46
SYMATTR Value 1
SYMBOL cap 320 848 R0
SYMATTR InstName C16
SYMATTR Value 1n
SYMBOL OpAmps\\ADTL084 496 848 M180
SYMATTR InstName U35
SYMBOL res -752 720 R90
WINDOW 0 0 56 VBottom 2
WINDOW 3 32 56 VTop 2
SYMATTR InstName R47
SYMATTR Value 10k
TEXT -4048 1080 Left 2 !.ac dec 100 1 48000
TEXT -4048 1032 Left 2 !;tran 0 250ms 230ms 0.0000762939453125
TEXT -4048 1120 Left 2 !;noise V(3) V3 oct 24 20 20k
TEXT -1528 640 Left 2 ;PreEmphasis
TEXT -1504 128 Left 2 ;360Hz LowPass
TEXT -2888 1728 Left 2 ;Reverb Fixed EQ
TEXT -2424 1720 Left 2 ;9KHz DIP Filter

The netlist it stands for:
* stargate_323_ltspice.asc
V1 V+ 0 15
V2 V- 0 -15
V3 FO 0 SINE(0 1 1000 0 0 0 1000) AC 1
XU1 0 N017 V+ V- N018 ADTL084  ; pins In+ In- V+ V- OUT
R69 N019 N011 75k
R70 N017 N019 18k
R71 N018 N017 91k
C46 N019 N011 1n
R105 N008 N011 1k6
R106 N010 N008 1k6
C70 N006 N008 220n
C69 0 N010 220n
XU2 N010 N006 V+ V- N006 ADTL084  ; pins In+ In- V+ V- OUT
C73 N009 N006 220n
R107 N004 N009 6k8
R108 N005 N004 56k
XU3 0 N004 V+ V- N005 ADTL084  ; pins In+ In- V+ V- OUT
XU4 0 N014 V+ V- N011 ADTL084  ; pins In+ In- V+ V- OUT
R78 N011 N014 10k
R80 N014 N013 10k
C49 N063 N054 220n
C2 0 N064 1000p
R76 N064 N063 3k3
R77 0 N063 33k
XU5 N064 N058 V+ V- N058 ADTL084  ; pins In+ In- V+ V- OUT
R75 N060 N058 7k5
C50 N060 N073 220p
R81 N073 N079 38.3k
R82 N079 0 38.3k
C54 N075 N079 1000p
XU6 N060 N057 V+ V- N057 ADTL084  ; pins In+ In- V+ V- OUT
XU7 N073 N075 V+ V- N075 ADTL084  ; pins In+ In- V+ V- OUT
R90 N059 N057 2.61k
XU8 N076 N084 V+ V- N088 ADTL084  ; pins In+ In- V+ V- OUT
XU10 N083 N087 V+ V- AIN1 ADTL084  ; pins In+ In- V+ V- OUT
XU11 N091 N084 V+ V- N080 ADTL084  ; pins In+ In- V+ V- OUT
XU13 N071 N083 V+ V- N083 ADTL084  ; pins In+ In- V+ V- OUT
R66 N069 N068 11.5k
R62 N076 N068 5.23k
C43 N076 N080 1000p
R61 N080 N084 11.8k
C37 N084 N088 1000p
R53 N088 N091 10k
R54 N091 0 10k
XU9 N077 N085 V+ V- N089 ADTL084  ; pins In+ In- V+ V- OUT
XU12 N092 N085 V+ V- N081 ADTL084  ; pins In+ In- V+ V- OUT
R67 N070 N069 12.1k
R59 N077 N069 9.31k
C42 N077 N081 1000p
R60 N081 N085 8.66k
C35 N085 N089 1000p
R52 N089 N092 10k
R51 N092 0 10k
XU14 N078 N086 V+ V- N090 ADTL084  ; pins In+ In- V+ V- OUT
XU15 N093 N086 V+ V- N082 ADTL084  ; pins In+ In- V+ V- OUT
R68 N071 N070 6.19k
R64 N078 N070 2k
C44 N078 N082 1000p
R65 N082 N086 12.1k
C38 N086 N090 1000p
R56 N090 N093 10k
R55 N093 0 10k
C45 N071 0 1000p
R57 AIN1 N087 20k
R58 0 N087 10k
XU16 0 N055 V+ V- N056 ADTL084  ; pins In+ In- V+ V- OUT
R2 N056 N055 10k
R3 N055 N059 2k
XU17 0 N053 V+ V- N054 ADTL084  ; pins In+ In- V+ V- OUT
R4 N054 N053 16.2k
C1 N054 N053 220p
R5 N053 N062 1k
R6 N007 N001 16k
XU18 0 N001 V+ V- N012 ADTL084  ; pins In+ In- V+ V- OUT
XU19 N007 N002 V+ V- N002 ADTL084  ; pins In+ In- V+ V- OUT
R8 N001 N005 33k
R7 RatLVL N002 100
R12 N002 N001 33k
D1 N012 N007 1N4148
C3 N061 N056 220n
R13 N061 N072 1k5
R14 N072 0 50k
D3 N074 0 BZX84C8V2L
D2 N074 N061 BZX84C8V2L
XU21 N061 N065 V+ V- N065 ADTL084  ; pins In+ In- V+ V- OUT
R15 N066 N065 3k3
R16 N067 N066 1
C4 N067 0 1n
XU22 N067 N068 V+ V- N068 ADTL084  ; pins In+ In- V+ V- OUT
R1 0 N062 1k
R18 N062 FO 221
C7 N062 0 220p
XU23 0 N025 V+ V- N013 ADTL084  ; pins In+ In- V+ V- OUT
R22 N025 N024 220
R23 N013 N025 47k
R9 N025 0 10k
XU20 FO N020 V+ V- N020 ADTL084  ; pins In+ In- V+ V- OUT
R11 N021 N020 100
C5 N022 N021 4.7µ
R17 N023 N022 25k
R19 0 N023 25k
R20 N024 N023 10k
D4 0 N024 1N4148
XU24 0 N003 V+ V- integrator ADTL084  ; pins In+ In- V+ V- OUT
R21 integrator N003 16.2k
C6 integrator N003 220p
R24 N003 FO 1k
R25 0 FO 1k
XU25 N036 N043 V+ V- N047 ADTL084  ; pins In+ In- V+ V- OUT
XU26 N042 N046 V+ V- AIN2 ADTL084  ; pins In+ In- V+ V- OUT
XU27 N050 N043 V+ V- N039 ADTL084  ; pins In+ In- V+ V- OUT
XU28 N033 N042 V+ V- N042 ADTL084  ; pins In+ In- V+ V- OUT
R10 N031 N030 11.5k
R26 N036 N030 5.23k
C8 N036 N039 1000p
R27 N039 N043 11.8k
C9 N043 N047 1000p
R28 N047 N050 10k
R29 N050 0 10k
XU29 N037 N044 V+ V- N048 ADTL084  ; pins In+ In- V+ V- OUT
XU30 N051 N044 V+ V- N040 ADTL084  ; pins In+ In- V+ V- OUT
R30 N032 N031 12.1k
R31 N037 N031 9.31k
C10 N037 N040 1000p
R32 N040 N044 8.66k
C11 N044 N048 1000p
R33 N048 N051 10k
R34 N051 0 10k
XU31 N038 N045 V+ V- N049 ADTL084  ; pins In+ In- V+ V- OUT
XU32 N052 N045 V+ V- N041 ADTL084  ; pins In+ In- V+ V- OUT
R35 N033 N032 6.19k
R36 N038 N032 2k
C12 N038 N041 1000p
R37 N041 N045 12.1k
C13 N045 N049 1000p
R38 N049 N052 10k
R39 N052 0 10k
C14 N033 0 1000p
R40 AIN2 N046 20k
R41 0 N046 10k
XU33 0 N015 V+ V- N016 ADTL084  ; pins In+ In- V+ V- OUT
R42 N016 N015 10k
C15 N026 N016 220n
R43 N026 N034 1k5
R44 N034 0 50k
D5 N035 0 BZX84C8V2L
D6 N035 N026 BZX84C8V2L
XU34 N026 N027 V+ V- N027 ADTL084  ; pins In+ In- V+ V- OUT
R45 N028 N027 3k3
R46 N029 N028 1
C16 N029 0 1n
XU35 N029 N030 V+ V- N030 ADTL084  ; pins In+ In- V+ V- OUT
R47 N015 N018 10k
.model D D
.lib standard.dio
.ac dec 100 1 48000
;tran 0 250ms 230ms 0.0000762939453125
;noise V(3) V3 oct 24 20 20k
* PreEmphasis
* 360Hz LowPass
* Reverb Fixed EQ
* 9KHz DIP Filter
.lib ADTL084.lib
.backanno
.end